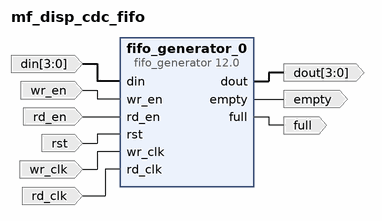
[diagram p0: block diagram of the top level]
# Vivado block design mf_disp_cdc_fifo, Vivado 2014.4
create_bd_design mf_disp_cdc_fifo

create_bd_port -dir O full
create_bd_port -dir I -from 3 -to 0 din
create_bd_port -dir I wr_en
create_bd_port -dir O empty
create_bd_port -dir O -from 3 -to 0 dout
create_bd_port -dir I rd_en
create_bd_port -dir I rst
create_bd_port -dir I wr_clk
create_bd_port -dir I rd_clk

create_bd_cell -type ip -vlnv xilinx.com:ip:fifo_generator:12.0 fifo_generator_0
set_property -dict [list \
  CONFIG.Fifo_Implementation Independent_Clocks_Distributed_RAM \
  CONFIG.Input_Data_Width 4 \
  CONFIG.Input_Depth 1024 \
] [get_bd_cells fifo_generator_0]

# ---- connections ----

connect_bd_net [get_bd_pins fifo_generator_0/full] [get_bd_ports full]
connect_bd_net [get_bd_ports din] [get_bd_pins fifo_generator_0/din]
connect_bd_net [get_bd_ports wr_en] [get_bd_pins fifo_generator_0/wr_en]
connect_bd_net [get_bd_pins fifo_generator_0/empty] [get_bd_ports empty]
connect_bd_net [get_bd_pins fifo_generator_0/dout] [get_bd_ports dout]
connect_bd_net [get_bd_ports rd_en] [get_bd_pins fifo_generator_0/rd_en]
connect_bd_net [get_bd_ports rst] [get_bd_pins fifo_generator_0/rst]
connect_bd_net [get_bd_ports wr_clk] [get_bd_pins fifo_generator_0/wr_clk]
connect_bd_net [get_bd_ports rd_clk] [get_bd_pins fifo_generator_0/rd_clk]

validate_bd_design
save_bd_design
